# Altium schematic sheet nm_temp_sens.SchDoc
size 209 x 297 mm; SheetNumber: 9; SheetTotal: 9
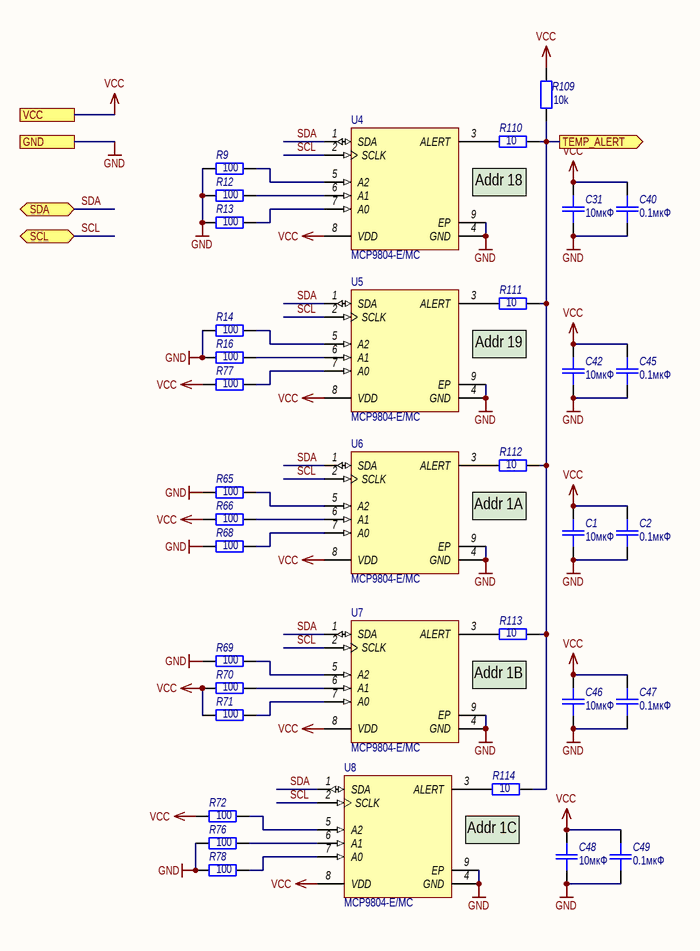
[diagram p0: nm_temp_sens.SchDoc]

## Parts
C1  10мкФ  [SMD_C0603]
C2  0.1мкФ  [SMD_C0603]
C31  10мкФ  [SMD_C0603]
C40  0.1мкФ  [SMD_C0603]
C42  10мкФ  [SMD_C0603]
C45  0.1мкФ  [SMD_C0603]
C46  10мкФ  [SMD_C0603]
C47  0.1мкФ  [SMD_C0603]
C48  10мкФ  [SMD_C0603]
C49  0.1мкФ  [SMD_C0603]
R9  100  [SMD_0603]
R12  100  [SMD_0603]
R13  100  [SMD_0603]
R14  100  [SMD_0603]
R16  100  [SMD_0603]
R65  100  [SMD_0603]
R66  100  [SMD_0603]
R68  100  [SMD_0603]
R69  100  [SMD_0603]
R70  100  [SMD_0603]
R71  100  [SMD_0603]
R72  100  [SMD_0603]
R76  100  [SMD_0603]
R77  100  [SMD_0603]
R78  100  [SMD_0603]
R109  10k  [SMD_0603]
R110  10  [SMD_0603]
R111  10  [SMD_0603]
R112  10  [SMD_0603]
R113  10  [SMD_0603]
R114  10  [SMD_0603]
U4  MCP9804-E/MC  [DFN-MC8]
U5  MCP9804-E/MC  [DFN-MC8]
U6  MCP9804-E/MC  [DFN-MC8]
U7  MCP9804-E/MC  [DFN-MC8]
U8  MCP9804-E/MC  [DFN-MC8]

## Ports
GND, SCL (bidir), SDA (bidir), TEMP_ALERT (out), VCC

## Nets
GND: C1.1 C2.1 C31.1 C40.1 C42.1 C45.1 C46.1 C47.1 C48.1 C49.1 R9.1 R12.1 R13.1 R14.1 R16.1 R65.1 R68.1 R69.1 R76.1 R78.1 U4.4(GND) U4.9(EP) U5.4(GND) U5.9(EP) U6.4(GND) U6.9(EP) U7.4(GND) U7.9(EP) U8.4(GND) U8.9(EP) ; port GND
VCC: C1.2 C2.2 C31.2 C40.2 C42.2 C45.2 C46.2 C47.2 C48.2 C49.2 R66.1 R70.1 R71.1 R72.1 R77.1 R109.2 U4.8(VDD) U5.8(VDD) U6.8(VDD) U7.8(VDD) U8.8(VDD) ; port VCC
SCL: U4.2(SCLK) U5.2(SCLK) U6.2(SCLK) U7.2(SCLK) U8.2(SCLK) ; port SCL
SDA: U4.1(SDA) U5.1(SDA) U6.1(SDA) U7.1(SDA) U8.1(SDA) ; port SDA
TEMP_ALERT: R109.1 R110.2 R111.2 R112.2 R113.2 R114.2 ; port TEMP_ALERT
NetR9_2: R9.2 U4.5(A2)
NetR12_2: R12.2 U4.6(A1)
NetR13_2: R13.2 U4.7(A0)
NetR14_2: R14.2 U5.5(A2)
NetR16_2: R16.2 U5.6(A1)
NetR65_2: R65.2 U6.5(A2)
NetR66_2: R66.2 U6.6(A1)
NetR68_2: R68.2 U6.7(A0)
NetR69_2: R69.2 U7.5(A2)
NetR70_2: R70.2 U7.6(A1)
NetR71_2: R71.2 U7.7(A0)
NetR72_2: R72.2 U8.5(A2)
NetR76_2: R76.2 U8.6(A1)
NetR77_2: R77.2 U5.7(A0)
NetR78_2: R78.2 U8.7(A0)
NetR110_1: R110.1 U4.3(ALERT)
NetR111_1: R111.1 U5.3(ALERT)
NetR112_1: R112.1 U6.3(ALERT)
NetR113_1: R113.1 U7.3(ALERT)
NetR114_1: R114.1 U8.3(ALERT)

## Notes on the sheet
- (near U4) Addr 18
- (near U5) Addr 19
- (near U6) Addr 1A
- (near U7) Addr 1B
- (near U8) Addr 1C
- Перв. примен.
- Справ. №
- Подп. и дата
- Инв. № дубл.
- Взам. инв. №
- Разраб.
- Изм.
- Лист
- № докум.
- Подп.
- Дата
- Литера
- Масса
- Масштаб
- Пров.
- Т.контр.
- Листов
- Инв. № подл.
- Н.контр.
- Утв.
- Форма 1 ГОСТ 2.104-2006
- Копировал
- Формат А4

## Library data of the parts
C1 C2 C31 C40 C42 C45-C49 = Capacitor: Назначение: SMD-конденсатор; Наименование: Конденсатор; Потребление, Вт: 0; Точность: %; Напряжение: В; Диэлектрик: *; Place_v1: *; Place_v2: *
  C1 C31 C42 C46 C48: Value: 10мкФ
  C2 C40 C45 C47 C49: Value: 0.1мкФ
R9 R12-R14 R16 R65 R66 R68-R72 R76-R78 R109-R114 = Resistor: Наименование: Резистор; Назначение: SMD-резистор; Потребление, Вт: 0,001; Описание: Резистор 0603 10K ±1% 100ppm/°C; Place_v1: *; Place_v2: *
  R9 R12-R14 R16 R65 R66 R68-R72 R76-R78: Value: 100
  R109: Value: 10k
  R110-R114: Value: 10
U4-U8 = CMP-0192-00111-1: ±0.25°C Typ. Accuracy Digital Temperature Sensor, 8-Pin DFN, Extended Temperature; PackageVersion: revBB, Aug-2009; PackageDescription: 8-Lead Plastic Dual Flat, No Lead Package (MC) - 2x3x0.9mm Body [DFN]; DatasheetVersion: revA, Sep-2009; PackageReference: DFN-MC8